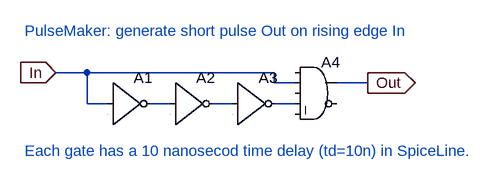
[diagram p0: schematic d50705b.asc]
d50705b.asc, the LTspice schematic file:
Version 4
SHEET 1 880 680
WIRE 16 144 -32 144
WIRE 304 144 16 144
WIRE 304 160 304 144
WIRE 336 160 304 160
WIRE 448 160 400 160
WIRE 16 192 16 144
WIRE 48 192 16 192
WIRE 144 192 112 192
WIRE 240 192 208 192
WIRE 336 192 304 192
FLAG -32 144 In
IOPIN -32 144 In
FLAG 448 160 Out
IOPIN 448 160 Out
SYMBOL Digital\\inv 48 128 R0
SYMATTR InstName A1
SYMATTR SpiceLine td=10n
SYMBOL Digital\\inv 144 128 R0
SYMATTR InstName A2
SYMATTR SpiceLine td=10n
SYMBOL Digital\\inv 240 128 R0
SYMATTR InstName A3
SYMATTR SpiceLine td=10n
SYMBOL Digital\\and 368 112 R0
SYMATTR InstName A4
SYMATTR SpiceLine td=10n
TEXT -80 264 Left 0 ;Each gate has a 10 nanosecod time delay (td=10n) in SpiceLine.
TEXT -80 80 Left 0 ;PulseMaker: generate short pulse Out on rising edge In

The netlist it stands for:
* d50705b.asc
A1 In 0 0 0 0 N001 0 0 BUF td=10n
A2 N001 0 0 0 0 N002 0 0 BUF td=10n
A3 N002 0 0 0 0 N003 0 0 BUF td=10n
A4 0 In 0 N003 0 0 Out 0 AND td=10n
* Each gate has a 10 nanosecod time delay (td=10n) in SpiceLine.
* PulseMaker: generate short pulse Out on rising edge In
.backanno
.end